# Altium schematic sheet RF_ADF.SchDoc
size 320 x 228 mm; DocumentNumber: 5; SheetNumber: 5; SheetTotal: 5
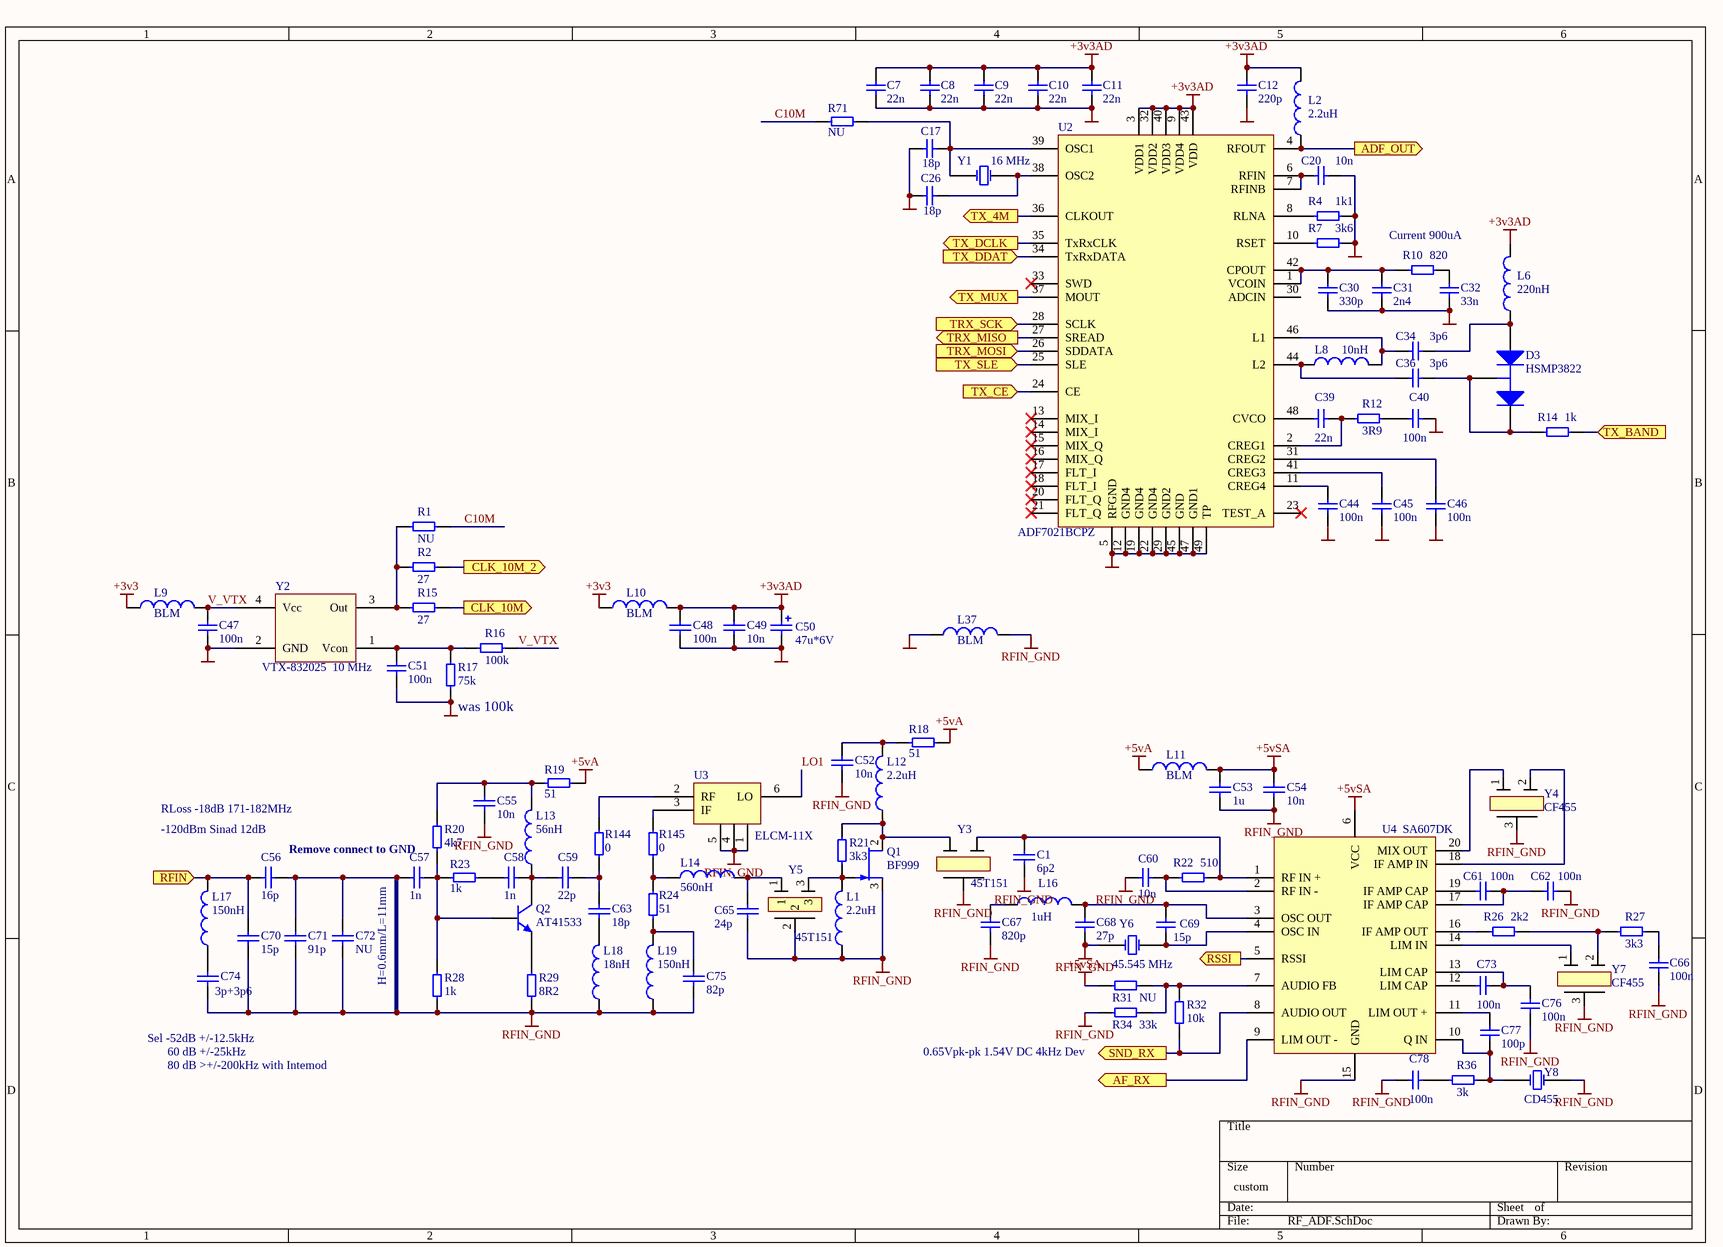
[diagram p0: RF_ADF.SchDoc]

## Parts
C1  6p2  [CAPC2012N]
C7  22n  [CAPC1608L]
C8  22n  [CAPC1608L]
C9  22n  [CAPC1608L]
C10  22n  [CAPC1608L]
C11  22n  [CAPC1608L]
C12  220p  [CAPC1608L]
C17  18p  [CAPC1608L]
C20  10n  [CAPC1608L]
C26  18p  [CAPC1608L]
C30  330p  [CAPC1608L]
C31  2n4  [CAPC1608L]
C32  33n  [CAPC1608L]
C34  3p6  [CAPC1608L]
C36  3p6  [CAPC1608L]
C39  22n  [CAPC1608L]
C40  100n  [CAPC1608L]
C44  100n  [CAPC1608L]
C45  100n  [CAPC1608L]
C46  100n  [CAPC1608L]
C47  100n  [CAPC1608L]
C48  100n  [CAPC1608N]
C49  10n  [CAPC1608N]
C50  47u*6V  [Case_A]
C51  100n  [CAPC1608L]
C52  10n  [CAPC2012N]
C53  1u  [CAPC2012L]
C54  10n  [CAPC1608L]
C55  10n  [CAPC2012N]
C56  16p  [CAPC2012N]
C57  1n  [CAPC2012N]
C58  1n  [CAPC2012N]
C59  22p  [CAPC2012N]
C60  10n  [CAPC1608L]
C61  100n  [CAPC1608L]
C62  100n  [CAPC1608L]
C63  18p  [CAPC2012N]
C65  24p  [CAPC2012N]
C66  100n  [CAPC1608L]
C67  820p  [CAPC1608L]
C68  27p  [CAPC1608L]
C69  15p  [CAPC1608L]
C70  15p  [CAPC2012N]
C71  91p  [CAPC2012N]
C72  NU  [CAPC2012N]
C73  100n  [CAPC1608L]
C74  3p+3p6  [CAPC2012N]
C75  82p  [CAPC2012N]
C76  100n  [CAPC1608L]
C77  100p  [CAPC1608L]
C78  100n  [CAPC1608L]
D3  HSMP3822  [SOT-23]
L1  2.2uH  [INDC2012N]
L2  2.2uH  [INDC2012L]
L6  220nH  [INDC2012L]
L8  10nH  [INDC2012L]
L9  BLM  [CAPC2012N]
L10  BLM  [CAPC2012N]
L11  BLM  [CAPC2012N]
L12  2.2uH  [INDC2012N]
L13  56nH  [INDC2012N]
L14  560nH  [INDC2012N]
L16  1uH  [INDC2012L]
L17  150nH  [INDC2012N]
L18  18nH  [INDC2012N]
L19  150nH  [INDC2012N]
L37  BLM  [CAPC2012N]
Q1  BF999  [sot23_n]
Q2  AT41533  [SOT-23]
R1  NU  [RESC1608L]
R2  27  [RESC1608L]
R4  1k1  [RESC1608L]
R7  3k6  [RESC1608L]
R10  820  [RESC1608L]
R12  3R9  [RESC1608L]
R14  1k  [RESC1608L]
R15  27  [RESC1608L]
R16  100k  [RESC1608L]
R17  75k  [RESC1608L]
R18  51  [RESC2012N]
R19  51  [RESC2012N]
R20  4k7  [RESC2012N]
R21  3k3  [RESC2012N]
R22  510  [RESC1608L]
R23  1k  [RESC2012N]
R24  51  [RESC2012N]
R26  2k2  [RESC1608L]
R27  3k3  [RESC1608L]
R28  1k  [RESC2012N]
R29  8R2  [RESC2012N]
R31  NU  [RESC1608L]
R32  10k  [RESC1608L]
R34  33k  [RESC1608L]
R36  3k  [RESC1608L]
R71  NU  [RESC1608L]
R144  0  [RESC1608L]
R145  0  [RESC1608L]
U2  ADF7021BCPZ  [QFN50P700X700X100-49N]
U3  ELCM-11X  [ELCM-11X]
U4  SA607DK  [SOT266-1]
Y1  16 MHz  [NX3225A]
Y2  VTX-832025  10 MHz  [SMD3.2x5]
Y3  45T151  [45T151AF]
Y4  CF455  [CFUCG455G]
Y5  45T151  [45T151AF]
Y6  45.545 MHz  [SIWARD UM-58]
Y7  CF455  [CFUCG455G]
Y8  CD455  [CDBC455CLX1]

## Ports
ADF_OUT (out), AF_RX (out), CLK_10M (out), CLK_10M_2 (out), RFIN (in), RSSI (out), SND_RX (out), TRX_MISO (out), TRX_MOSI (in), TRX_SCK (in), TX_4M (out), TX_BAND (in), TX_CE (in), TX_DCLK (out), TX_DDAT (in), TX_MUX (out), TX_SLE (in)

## Nets
+3v3: L9.1 L10.1
+3v3AD: C7.1 C8.1 C9.1 C10.1 C11.1 C12.1 C48.2 C49.2 C50.1 L2.2 L6.2 L10.2 U2.3(VDD1) U2.9(VDD4) U2.32(VDD2) U2.40(VDD3) U2.43(VDD)
+5vA: L11.1 R18.2 R19.2
+5vSA: C53.2 C54.2 L11.2 R31.2 U4.6(VCC)
GND: C7.2 C8.2 C9.2 C10.2 C11.2 C12.2 C17.1 C20.1 C26.2 C30.2 C31.2 C32.2 C40.1 C44.2 C45.2 C46.2 C47.2 C48.1 C49.1 C50.2 C51.2 L37.1 R4.1 R7.1 R17.2 U2.5(RFGND) U2.12(GND4) U2.19(GND4) U2.22(GND4) U2.29(GND2) U2.45(GND) U2.47(GND1) U2.49(TP) Y2.2(GND)
RFIN_GND: C1.1 C52.1 C53.1 C54.1 C55.1 C56.1 C57.2 C60.1 C62.2 C65.1 C66.2 C67.1 C68.1 C70.1 C71.1 C71.2 C72.1 C72.2 C74.1 C75.1 C76.1 C78.1 L1.1 L18.1 L19.1 L37.2 Q1.3(S) R28.2 R29.2 R34.1 U3.1(GND) U3.4(GND) U3.5(GND) U4.15(GND) Y3.2 Y4.3(GND) Y5.2 Y6.2(OSC2) Y7.3 Y8.2(OSC2)
ADF_OUT: L2.1 U2.4(RFOUT) ; port ADF_OUT
AF_RX: U4.9(LIM_OUT_-) ; port AF_RX
C10M: R1.1 R71.1
CLK_10M: R15.1 ; port CLK_10M
CLK_10M_2: R2.1 ; port CLK_10M_2
LO1: U3.6(LO)
RFIN: C56.2 C70.2 L17.2 ; port RFIN
RSSI: U4.5(RSSI) ; port RSSI
SND_RX: R32.2 U4.8(AUDIO_OUT) ; port SND_RX
TRX_MISO: U2.27(SREAD) ; port TRX_MISO
TRX_MOSI: U2.26(SDDATA) ; port TRX_MOSI
TRX_SCK: U2.28(SCLK) ; port TRX_SCK
TX_4M: U2.36(CLKOUT) ; port TX_4M
TX_BAND: R14.1 ; port TX_BAND
TX_CE: U2.24(CE) ; port TX_CE
TX_DCLK: U2.35(TxRxCLK) ; port TX_DCLK
TX_DDAT: U2.34(TxRxDATA) ; port TX_DDAT
TX_MUX: U2.37(MOUT) ; port TX_MUX
TX_SLE: U2.25(SLE) ; port TX_SLE
V_VTX: C47.1 L9.2 R16.1 Y2.4(Vcc)
NetC1_2: C1.2 R22.1 U4.1(RF_IN_+) Y3.3
NetC17_2: C17.2 R71.2 U2.39(OSC1) Y1.1(OSC1)
NetC20_2: C20.2 U2.6(RFIN) U2.7(RFINB)
NetC26_1: C26.1 U2.38(OSC2) Y1.2(OSC2)
NetC30_1: C30.1 C31.1 R10.2 U2.1(VCOIN) U2.42(CPOUT)
NetC32_1: C32.1 R10.1
NetC34_1: C34.1 D3.1(A) L6.1
NetC34_2: C34.2 L8.2 U2.46(L1)
NetC36_1: C36.1 D3.2(K) D3.3(C) R14.2
NetC36_2: C36.2 L8.1 U2.44(L2)
NetC39_1: C39.1 R12.2 U2.2(CREG1)
NetC39_2: C39.2 U2.48(CVCO)
NetC40_2: C40.2 R12.1
NetC44_1: C44.1 U2.11(CREG4)
NetC45_1: C45.1 U2.41(CREG3)
NetC46_1: C46.1 U2.31(CREG2)
NetC51_1: C51.1 R16.2 R17.1 Y2.1(Vcon)
NetC52_2: C52.2 L12.2 R18.1
NetC55_2: C55.2 L13.2 R19.1 R20.1
NetC57_1: C57.1 Q2.1(B) R20.2 R23.1 R28.1
NetC58_1: C58.1 C59.2 L13.1 Q2.3(C)
NetC58_2: C58.2 R23.2
NetC59_1: C59.1 C63.2 R144.2
NetC60_2: C60.2 R22.2 U4.2(RF_IN_-)
NetC61_1: C61.1 U4.19(IF_AMP_CAP)
NetC61_2: C61.2 C62.1 U4.17(IF_AMP_CAP)
NetC63_1: C63.1 L18.2
NetC65_2: C65.2 L14.2 Y5.1
NetC66_1: C66.1 R27.1
NetC67_2: C67.2 L16.1
NetC68_2: C68.2 C69.2 L16.2 U4.3(OSC_OUT)
NetC69_1: C69.1 U4.4(OSC_IN) Y6.1(OSC1)
NetC73_1: C73.1 U4.12(LIM_CAP)
NetC73_2: C73.2 C76.2 U4.13(LIM_CAP)
NetC74_2: C74.2 L17.1
NetC75_2: C75.2 L19.2 R24.2
NetC77_1: C77.1 R36.1 U4.10(Q_IN) Y8.1(OSC1)
NetC77_2: C77.2 U4.11(LIM_OUT_+)
NetC78_2: C78.2 R36.2
NetL1_2: L1.2 Q1.1(G) R21.2 Y5.3
NetL12_1: L12.1 Q1.2(D) R21.1 Y3.1
NetL14_1: L14.1 R24.1 R145.2
NetQ2_2: Q2.2(E) R29.1
NetR1_2: R1.2 R2.2 R15.2 Y2.3(Out)
NetR4_2: R4.2 U2.8(RLNA)
NetR7_2: R7.2 U2.10(RSET)
NetR26_1: R26.1 R27.2 Y7.2
NetR26_2: R26.2 U4.16(IF_AMP_OUT)
NetR31_1: R31.1 R32.1 R34.2 U4.7(AUDIO_FB)
NetR144_1: R144.1 U3.2(RF)
NetR145_1: R145.1 U3.3(IF)
NetU4_14: U4.14(LIM_IN) Y7.1
NetU4_18: U4.18(IF_AMP_IN) Y4.2(Out)
NetU4_20: U4.20(MIX_OUT) Y4.1(In)

Not connected (* = marked no-connect by the designer): U2 13(MIX_I)* 14(MIX_I)* 15(MIX_Q)* 16(MIX_Q)* 17(FLT_I)* 18(FLT_I)* 20(FLT_Q)* 21(FLT_Q)* 23(TEST_A)* 30(ADCIN) 33(SWD)*

## Notes on the sheet
- Current 900uA
- (near R17) was 100k
- -120dBm Sinad 12dB
- RLoss -18dB 171-182MHz
- Remove connect to GND
- H=0.6mm/L=11mm
- (near C74) Sel -52dB +/-12.5kHz
- 60 dB +/-25kHz
- (near R34) 0.65Vpk-pk 1.54V DC 4kHz Dev
- 80 dB >+/-200kHz with Intemod

## Library data of the parts
C1 C7-C12 C17 C20 C26 C30-C32 C34 C36 C39 C40 C44-C49 C51-C63 C65-C78 = Cap: Capacitor; Value: 100pF; Published: 8-Jun-2000; LatestRevisionDate: 17-Jul-2002; LatestRevisionNote: Re-released for DXP Platform.; PackageReference: RAD-0.3; Publisher: Altium Limited
C50 = Cap Pol: Polarized Capacitor (Surface Mount); Value: 100pF; Published: 8-Jun-2000; LatestRevisionDate: 17-Jul-2002; LatestRevisionNote: Re-released for DXP Platform.; PackageReference: C0805; Publisher: Altium Limited
D3 = SMBD7000: Silicon Switching Diode Array for High-Speed Switching; Type: Диод; Published: 21-Mar-2003; DatasheetDocument: Oct-1999; PackageDocument: Sep-2001; PackageReference: SOT-23; Publisher: Altium Limited; ComponentLink1Description: Manufacturer Link; ComponentLink1URL: http://www.infineon.com/
L1 L12-L14 L17-L19 = Inductor: Code_IEC: 1005; Value: 10mH; Published: 8-Jun-2000; LatestRevisionDate: 17-Jul-2002; LatestRevisionNote: Re-released for DXP Platform.; PackageReference: 0402-A; Publisher: Altium Limited; Code_JEITA: 0402
L2 L6 L8 L16 = INDUCTOR: Type: Индуктивность
L9-L11 L37 = Ferrite Bead: Code_IEC: 1005; Value: 10mH; Published: 8-Jun-2000; LatestRevisionDate: 17-Jul-2002; LatestRevisionNote: Re-released for DXP Platform.; PackageReference: 0402-A; Publisher: Altium Limited; Code_JEITA: 0402
Q1 = BF999: N-channel Silicon Junction Field-effect Transistor; Published: 17-Sep-2003; LatestRevisionDate: 12-Dec-2006; LatestRevisionNote: IPC-7351 Footprint Added.; DatasheetVersion: 29-Jul-1996; PackageVersion: May-1999; PackageReference: SOT23; Publisher: Altium Limited; PackageDescription: 3-Pin SOT-23 Package 0.95 mm Pitch, 2.3 mm Lead Span; ComponentLink1Description: Manufacturer Link; ComponentLink1URL: http://www.semiconductors.philips.com/; ComponentLink2Description: Datasheet; ComponentLink2URL: http://www.semiconductors.philips.com/acrobat/datasheets/BF545A_BF545B_BF545C_3.pdf
Q2 = BFR92A: NPN 5 GHz Wideband Transistor; Published: 17-Sep-2003; LatestRevisionDate: 12-Dec-2006; LatestRevisionNote: IPC-7351 Footprint Added.; DatasheetVersion: 29-Oct-1997; PackageVersion: May-1999; PackageReference: SOT23; Publisher: Altium Limited; PackageDescription: 3-Pin SOT-23 Package 0.95 mm Pitch, 2.3 mm Lead Span; ComponentLink1Description: Manufacturer Link; ComponentLink1URL: http://www.semiconductors.philips.com/; ComponentLink2Description: Datasheet; ComponentLink2URL: http://www.semiconductors.philips.com/acrobat/datasheets/BFR92A_2.pdf
R1 R2 R4 R7 R10 R12 R15-R22 R24 R26 R27 R29 R31 R32 R34 R36 R71 R144 R145 = Res: Resistor; Value: 1K; Published: 8-Jun-2000; LatestRevisionDate: 04-Mar-2005; LatestRevisionNote: PCB Footprint replaced.; PackageReference: J1-0603; Publisher: Altium Limited
R14 R23 R28 = Res: Resistor; Published: 8-Jun-2000; LatestRevisionDate: 04-Mar-2005; LatestRevisionNote: PCB Footprint replaced.; PackageReference: J1-0603; Publisher: Altium Limited; Value: 1K
U2 = ADF7021: ISM Band, FSK/ASK Tranceiver IC
U3 = ELCM-11X: Broadband mixer
U4 = SA607: Low-voltage high perfomance mixer FM IF system
Y1 Y6 = XTAL: Crystal Oscillator; Published: 8-Jun-2000; LatestRevisionDate: 17-Jul-2002; LatestRevisionNote: Re-released for DXP Platform.; PackageReference: R38; Publisher: Altium Limited
Y2 = KT18B-DCU28B
Y3 Y5 = SFE10.7MS3: 10.7 IF Filter
Y4 Y7 = SFE10.7MS3: 455k IF Filter
Y8 = XTAL: 455k Discriminator; Published: 8-Jun-2000; LatestRevisionDate: 17-Jul-2002; LatestRevisionNote: Re-released for DXP Platform.; PackageReference: R38; Publisher: Altium Limited